# Altium schematic sheet sheet_top.SchDoc
size A4
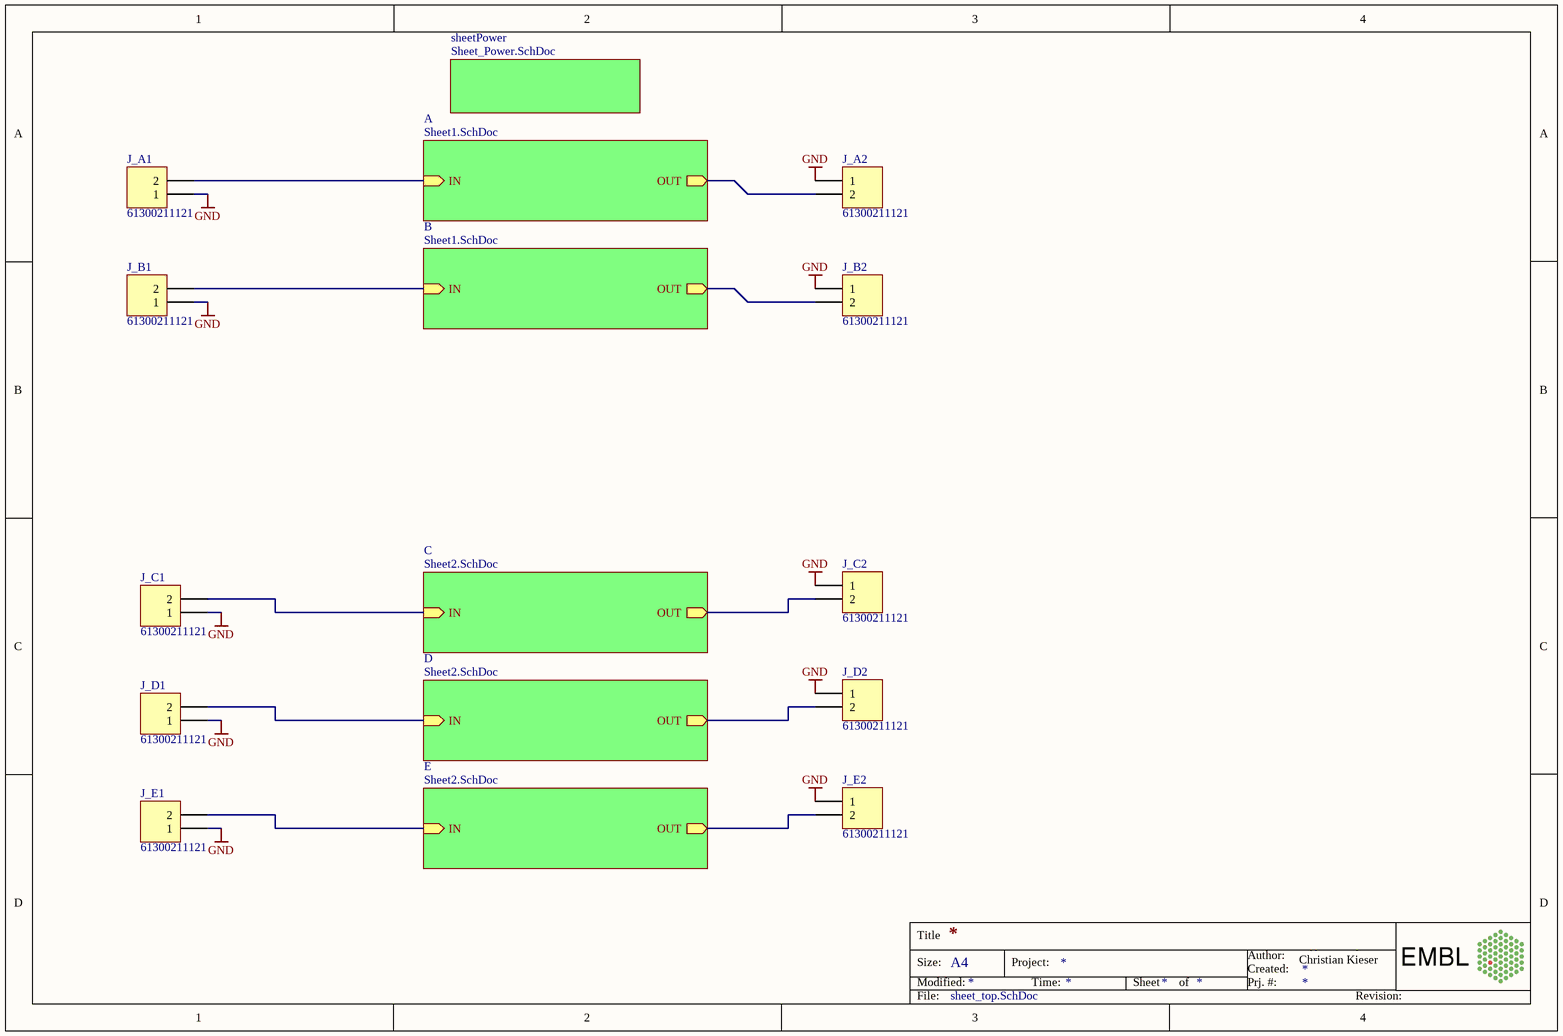
[diagram p0: sheet_top.SchDoc]

## Parts
J_A1  61300211121  [61300211121]
J_A2  61300211121  [61300211121]
J_B1  61300211121  [61300211121]
J_B2  61300211121  [61300211121]
J_C1  61300211121  [61300211121]
J_C2  61300211121  [61300211121]
J_D1  61300211121  [61300211121]
J_D2  61300211121  [61300211121]
J_E1  61300211121  [61300211121]
J_E2  61300211121  [61300211121]

## Sub-sheets
A = Sheet1.SchDoc: OUT (out), IN (in)
B = Sheet1.SchDoc: OUT (out), IN (in)
C = Sheet2.SchDoc: OUT (out), IN (in)
D = Sheet2.SchDoc: OUT (out), IN (in)
E = Sheet2.SchDoc: OUT (out), IN (in)
sheetPower = Sheet_Power.SchDoc: no entries

## Nets
GND: J_A1.1 J_A2.1 J_B1.1 J_B2.1 J_C1.1 J_C2.1 J_D1.1 J_D2.1 J_E1.1 J_E2.1
NetJ_A1_2: J_A1.2 ; sheet A/IN
NetJ_A2_2: J_A2.2 ; sheet A/OUT
NetJ_B1_2: J_B1.2 ; sheet B/IN
NetJ_B2_2: J_B2.2 ; sheet B/OUT
NetJ_C1_2: J_C1.2 ; sheet C/IN
NetJ_C2_2: J_C2.2 ; sheet C/OUT
NetJ_D1_2: J_D1.2 ; sheet D/IN
NetJ_D2_2: J_D2.2 ; sheet D/OUT
NetJ_E1_2: J_E1.2 ; sheet E/IN
NetJ_E2_2: J_E2.2 ; sheet E/OUT

## Notes on the sheet
- Christian Kieser
- Title
- Size:
- Modified:
- A4
- Project:
- Time:
- Sheet
- of
- Created:
- Author:
- Prj. #:
- Alfons Riedinger
- File:
- Revision:

## Library data of the parts
J_A1 J_A2 J_B1 J_B2 J_C1 J_C2 J_D1 J_D2 J_E1 J_E2 = CMP-001-0071-1: 2Pol; gerade; WR-PHD 2.54 mm THT Pin Header; Brand: Wurth Electronics; Current Rating: 3 A; Insulation Resistance: 1 GOhms; Latching Type: Unlatched; Mating Post Length: 6 mm; Mounting Angle: Straight; Number of Positions: 2 Position; Pitch: 2.54 mm; Voltage Rating: 250 V; Accessory Type: -; Application: Wire to Board; ComponentLink1Description: 6130xx11121-538006.pdf; ComponentLink1URL: http://www.mouser.com/ds/2/445/6130xx11121-538006.pdf; Contact Gender: Pin (Male); Contact Material: Copper Alloy; Contact Plating: Gold; Contact Type: -; Flammability Rating: UL 94 V-0; Housing Gender: -; Housing Material: Polybutylene Terephthalate (PBT); Manufacturer: Wurth Electronics; Manufacturer Part Number: 61300211121; Minimum Order Quantity: 1; Mounting Style: Straight Pin; Number of Rows: 1 Row; Packaging: Bulk; Product: Headers; Reeling: False; RoHS - Mouser: Y; Row Spacing: -; Series: WR-PHD; Standard Pack Qty: 1000; Supplier: Mouser; Supplier Part Number: 710-61300211121; Termination Post Length: 3 mm; Termination Style: Through Hole; Type: Pin Strip; PartNumber: 61300211121